# Altium schematic sheet Communication_Main.SchDoc: EMRT MAIN CONTROLLER
size B; DrawnBy: HUST; DocumentNumber: 9321-E-1101; Revision: REV.B; SheetNumber: 1; SheetTotal: 4
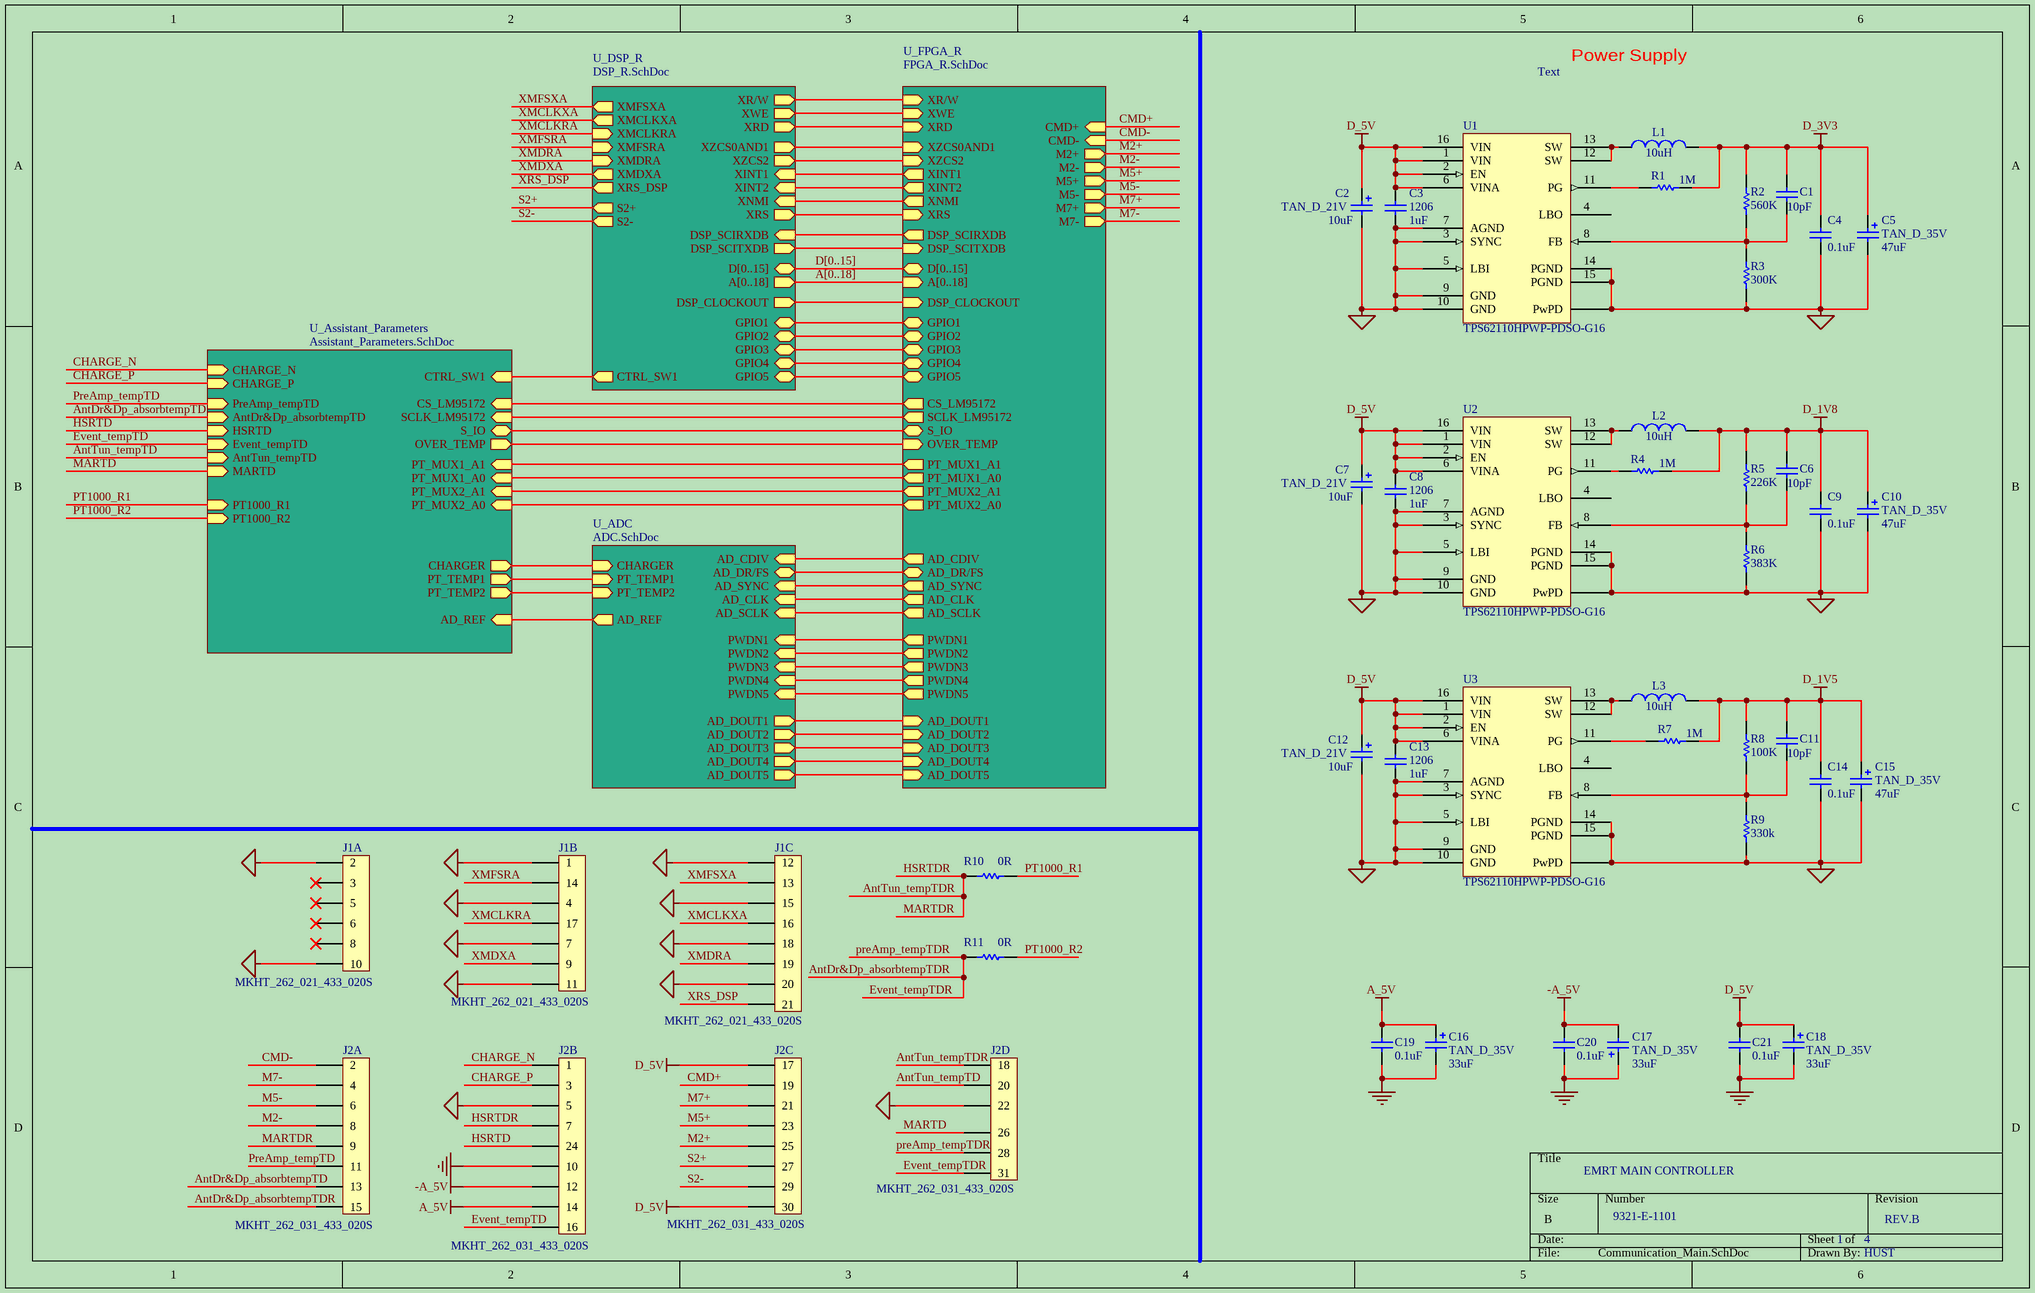
[diagram p0: Communication_Main.SchDoc]

## Parts
C1  value 10pF  [CAPS0805_57]  (hidden comment: Cap)
C2  TAN_D_21V  value 10uF  [CAPSP_2q2917]
C3  1206  value 1uF  [CAPS1206_43]
C4  value 0.1uF  [CAPS0805_57]  (hidden comment: Cap)
C5  TAN_D_35V  value 47uF  [CAPSP_2q2917]
C6  value 10pF  [CAPS0805_57]  (hidden comment: Cap)
C7  TAN_D_21V  value 10uF  [CAPSP_2q2917]
C8  1206  value 1uF  [CAPS1206_43]
C9  value 0.1uF  [CAPS0805_57]  (hidden comment: Cap)
C10  TAN_D_35V  value 47uF  [CAPSP_2q2917]
C11  value 10pF  [CAPS0805_57]  (hidden comment: Cap)
C12  TAN_D_21V  value 10uF  [CAPSP_2q2917]
C13  1206  value 1uF  [CAPS1206_43]
C14  value 0.1uF  [CAPS0805_57]  (hidden comment: Cap)
C15  TAN_D_35V  value 47uF  [CAPSP_2q2917]
C16  TAN_D_35V  value 33uF  [CAPSP_2q2917]
C17  TAN_D_35V  value 33uF  [CAPSP_2q2917]
C18  TAN_D_35V  value 33uF  [CAPSP_2q2917]
C19  value 0.1uF  [CAPS0805_57]  (hidden comment: Cap)
C20  value 0.1uF  [CAPS0805_57]  (hidden comment: Cap)
C21  value 0.1uF  [CAPS0805_57]  (hidden comment: Cap)
J1  MKHT_262_021_433_020S  [MKHT_262_021_433_020S]  (parts A,B,C of 3)
J2  MKHT_262_031_433_020S  [MKHT_262_031_433_020S]  (parts A,B,C,D of 4)
L1  value 10uH  [Inductor_HT]  (hidden comment: Inductor)
L2  value 10uH  [Inductor_HT]  (hidden comment: Inductor)
L3  value 10uH  [Inductor_HT]  (hidden comment: Inductor)
R1  value 1M  [RESS0805]  (hidden comment: Res)
R2  value 560K  [RESS0805]  (hidden comment: Res)
R3  value 300K  [RESS0805]  (hidden comment: Res)
R4  value 1M  [RESS0805]  (hidden comment: Res)
R5  value 226K  [RESS0805]  (hidden comment: Res)
R6  value 383K  [RESS0805]  (hidden comment: Res)
R7  value 1M  [RESS0805]  (hidden comment: Res)
R8  value 100K  [RESS0805]  (hidden comment: Res)
R9  value 330k  [RESS0805]  (hidden comment: Res)
R10  value 0R  [RESS0805]  (hidden comment: Res)
R11  value 0R  [RESS0805]  (hidden comment: Res)
U1  TPS62110HPWP-PDSO-G16  [PWP16]
U2  TPS62110HPWP-PDSO-G16  [PWP16]
U3  TPS62110HPWP-PDSO-G16  [PWP16]

## Sub-sheets
U_ADC = ADC.SchDoc: AD_CDIV (in), AD_DR/FS (bidir), AD_SYNC (in), PWDN1 (in), PWDN2 (in), PWDN3 (in), PWDN4 (in), AD_CLK (in), AD_SCLK (in), AD_DOUT1 (out), AD_DOUT2 (out), AD_DOUT3 (out), AD_DOUT4 (out), PT_TEMP1 (in), CHARGER (in), AD_DOUT5 (out), PWDN5 (in), AD_REF (out), PT_TEMP2 (in)
U_Assistant_Parameters = Assistant_Parameters.SchDoc: HSRTD (in), PT_TEMP1 (out), CHARGE_N (in), CHARGE_P (in), CHARGER (out), PreAmp_tempTD (in), PT1000_R1 (in), AntDr&Dp_absorbtempTD (in), CS_LM95172 (in), SCLK_LM95172 (in), S_IO (bidir), OVER_TEMP (out), Event_tempTD (in), PT_MUX2_A1 (in), PT_MUX2_A0 (in), PT_MUX1_A1 (in), PT_MUX1_A0 (in), AntTun_tempTD (in), MARTD (in), AD_REF (in), PT_TEMP2 (out), PT1000_R2 (in), CTRL_SW1 (in)
U_DSP_R = DSP_R.SchDoc: XMDXA (out), XMFSXA (out), XMCLKXA (out), XMCLKRA (in), XMFSRA (in), XMDRA (in), GPIO1 (bidir), GPIO2 (bidir), GPIO3 (bidir), GPIO4 (bidir), XRS_DSP (out), XZCS2 (out), XWE (out), XRD (out), XNMI (in), XINT1 (in), DSP_CLOCKOUT (out), GPIO5 (bidir), XINT2 (in), A[0..18] (out), D[0..15] (bidir), XZCS0AND1 (out), XRS (out), XR/W (out), DSP_SCIRXDB (in), DSP_SCITXDB (out), CTRL_SW1 (out), S2+ (out), S2- (out)
U_FPGA_R = FPGA_R.SchDoc: XINT1 (out), XNMI (out), XWE (in), XRD (in), XR/W (in), XZCS2 (in), GPIO1 (bidir), GPIO2 (bidir), GPIO3 (bidir), GPIO4 (bidir), DSP_CLOCKOUT (in), M2+ (out), M2- (out), CMD- (in), CMD+ (in), M5+ (out), M5- (out), M7+ (out), M7- (out), GPIO5 (bidir), XINT2 (out), D[0..15] (bidir), XRS (in), A[0..18] (in), XZCS0AND1 (in), AD_DOUT2 (in), AD_DOUT3 (in), AD_DOUT4 (in), AD_DOUT1 (in), AD_CDIV (out), AD_DR/FS (bidir), AD_SYNC (out), PWDN2 (out), PWDN3 (out), PWDN4 (out), PWDN1 (out), AD_CLK (out), AD_SCLK (out), CS_LM95172 (out), SCLK_LM95172 (out), S_IO (bidir), OVER_TEMP (in), AD_DOUT5 (in), PWDN5 (out), DSP_SCIRXDB (out), DSP_SCITXDB (in), PT_MUX2_A1 (out), PT_MUX2_A0 (out), PT_MUX1_A0 (out), PT_MUX1_A1 (out)

## Nets
-A_5V: C17.2 C20.1 J2.12
A_5V: C16.1 C19.2 J2.14
D_1V5: C11.2 C14.2 C15.1 L3.2 R7.2 R8.2
D_1V8: C6.2 C9.2 C10.1 L2.2 R4.2 R5.2
D_3V3: C1.2 C4.2 C5.1 L1.2 R1.2 R2.2
D_5V: C2.1 C3.2 C7.1 C8.2 C12.1 C13.2 C18.1 C21.1 J2.17 J2.30 U1.1(VIN) U1.2(EN) U1.6(VINA) U1.16(VIN) U2.1(VIN) U2.2(EN) U2.6(VINA) U2.16(VIN) U3.1(VIN) U3.2(EN) U3.6(VINA) U3.16(VIN)
DGND: C2.2 C3.1 C4.1 C5.2 C7.2 C8.1 C9.1 C10.2 C12.2 C13.1 C14.1 C15.2 J1.1 J1.2 J1.4 J1.7 J1.10 J1.11 J1.12 J1.15 J1.18 J1.20 J2.5 J2.22 R3.1 R6.1 R9.1 U1.3(SYNC) U1.5(LBI) U1.7(AGND) U1.9(GND) U1.10(GND) U1.14(PGND) U1.15(PGND) U1.PwPD U2.3(SYNC) U2.5(LBI) U2.7(AGND) U2.9(GND) U2.10(GND) U2.14(PGND) U2.15(PGND) U2.PwPD U3.3(SYNC) U3.5(LBI) U3.7(AGND) U3.9(GND) U3.10(GND) U3.14(PGND) U3.15(PGND) U3.PwPD
GND: C16.2 C17.1 C18.2 C19.1 C20.2 C21.2 J2.10
AntDr&Dp_absorbtempTD: J2.13 ; sheet U_Assistant_Parameters/AntDr&Dp_absorbtempTD
AntDr&Dp_absorbtempTDR: J2.15 J2.28 J2.31 R11.2  [also labelled Event_tempTDR, preAmp_tempTDR]
AntTun_tempTD: J2.20 ; sheet U_Assistant_Parameters/AntTun_tempTD
AntTun_tempTDR: J2.7 J2.9 J2.18 R10.2  [also labelled HSRTDR, MARTDR]
CHARGE_N: J2.1 ; sheet U_Assistant_Parameters/CHARGE_N
CHARGE_P: J2.3 ; sheet U_Assistant_Parameters/CHARGE_P
CMD+: J2.19 ; sheet U_FPGA_R/CMD+
CMD-: J2.2 ; sheet U_FPGA_R/CMD-
Event_tempTD: J2.16 ; sheet U_Assistant_Parameters/Event_tempTD
HSRTD: J2.24 ; sheet U_Assistant_Parameters/HSRTD
M2+: J2.25 ; sheet U_FPGA_R/M2+
M2-: J2.8 ; sheet U_FPGA_R/M2-
M5+: J2.23 ; sheet U_FPGA_R/M5+
M5-: J2.6 ; sheet U_FPGA_R/M5-
M7+: J2.21 ; sheet U_FPGA_R/M7+
M7-: J2.4 ; sheet U_FPGA_R/M7-
MARTD: J2.26 ; sheet U_Assistant_Parameters/MARTD
PreAmp_tempTD: J2.11 ; sheet U_Assistant_Parameters/PreAmp_tempTD
PT1000_R1: R10.1 ; sheet U_Assistant_Parameters/PT1000_R1
PT1000_R2: R11.1 ; sheet U_Assistant_Parameters/PT1000_R2
S2+: J2.27 ; sheet U_DSP_R/S2+
S2-: J2.29 ; sheet U_DSP_R/S2-
XMCLKRA: J1.17 ; sheet U_DSP_R/XMCLKRA
XMCLKXA: J1.16 ; sheet U_DSP_R/XMCLKXA
XMDRA: J1.19 ; sheet U_DSP_R/XMDRA
XMDXA: J1.9 ; sheet U_DSP_R/XMDXA
XMFSRA: J1.14 ; sheet U_DSP_R/XMFSRA
XMFSXA: J1.13 ; sheet U_DSP_R/XMFSXA
XRS_DSP: J1.21 ; sheet U_DSP_R/XRS_DSP
NetC1_1: C1.1 R2.1 R3.2 U1.8(FB)
NetC6_1: C6.1 R5.1 R6.2 U2.8(FB)
NetC11_1: C11.1 R8.1 R9.2 U3.8(FB)
NetL1_1: L1.1 U1.12(SW) U1.13(SW)
NetL2_1: L2.1 U2.12(SW) U2.13(SW)
NetL3_1: L3.1 U3.12(SW) U3.13(SW)
NetR1_1: R1.1 U1.11(PG)
NetR4_1: R4.1 U2.11(PG)
NetR7_1: R7.1 U3.11(PG)
(unnamed): sheet U_Assistant_Parameters/PT_TEMP1, sheet U_ADC/PT_TEMP1
(unnamed): sheet U_Assistant_Parameters/CHARGER, sheet U_ADC/CHARGER
(unnamed): sheet U_Assistant_Parameters/CS_LM95172, sheet U_FPGA_R/CS_LM95172
(unnamed): sheet U_Assistant_Parameters/SCLK_LM95172, sheet U_FPGA_R/SCLK_LM95172
(unnamed): sheet U_Assistant_Parameters/S_IO, sheet U_FPGA_R/S_IO
(unnamed): sheet U_Assistant_Parameters/OVER_TEMP, sheet U_FPGA_R/OVER_TEMP
(unnamed): sheet U_Assistant_Parameters/PT_MUX2_A1, sheet U_FPGA_R/PT_MUX2_A1
(unnamed): sheet U_Assistant_Parameters/PT_MUX2_A0, sheet U_FPGA_R/PT_MUX2_A0
(unnamed): sheet U_Assistant_Parameters/PT_MUX1_A1, sheet U_FPGA_R/PT_MUX1_A1
(unnamed): sheet U_Assistant_Parameters/PT_MUX1_A0, sheet U_FPGA_R/PT_MUX1_A0
(unnamed): sheet U_Assistant_Parameters/AD_REF, sheet U_ADC/AD_REF
(unnamed): sheet U_Assistant_Parameters/PT_TEMP2, sheet U_ADC/PT_TEMP2
(unnamed): sheet U_Assistant_Parameters/CTRL_SW1, sheet U_DSP_R/CTRL_SW1
(unnamed): sheet U_DSP_R/GPIO1, sheet U_FPGA_R/GPIO1
(unnamed): sheet U_DSP_R/GPIO2, sheet U_FPGA_R/GPIO2
(unnamed): sheet U_DSP_R/GPIO3, sheet U_FPGA_R/GPIO3
(unnamed): sheet U_DSP_R/GPIO4, sheet U_FPGA_R/GPIO4
(unnamed): sheet U_DSP_R/XZCS2, sheet U_FPGA_R/XZCS2
(unnamed): sheet U_DSP_R/XWE, sheet U_FPGA_R/XWE
(unnamed): sheet U_DSP_R/XRD, sheet U_FPGA_R/XRD
(unnamed): sheet U_DSP_R/XNMI, sheet U_FPGA_R/XNMI
(unnamed): sheet U_DSP_R/XINT1, sheet U_FPGA_R/XINT1
(unnamed): sheet U_DSP_R/DSP_CLOCKOUT, sheet U_FPGA_R/DSP_CLOCKOUT
(unnamed): sheet U_DSP_R/GPIO5, sheet U_FPGA_R/GPIO5
(unnamed): sheet U_DSP_R/XINT2, sheet U_FPGA_R/XINT2
(unnamed): sheet U_DSP_R/XZCS0AND1, sheet U_FPGA_R/XZCS0AND1
(unnamed): sheet U_DSP_R/XRS, sheet U_FPGA_R/XRS
(unnamed): sheet U_DSP_R/XR/W, sheet U_FPGA_R/XR/W
(unnamed): sheet U_DSP_R/DSP_SCIRXDB, sheet U_FPGA_R/DSP_SCIRXDB
(unnamed): sheet U_DSP_R/DSP_SCITXDB, sheet U_FPGA_R/DSP_SCITXDB
(unnamed): sheet U_FPGA_R/AD_DOUT2, sheet U_ADC/AD_DOUT2
(unnamed): sheet U_FPGA_R/AD_DOUT3, sheet U_ADC/AD_DOUT3
(unnamed): sheet U_FPGA_R/AD_DOUT4, sheet U_ADC/AD_DOUT4
(unnamed): sheet U_FPGA_R/AD_DOUT1, sheet U_ADC/AD_DOUT1
(unnamed): sheet U_FPGA_R/AD_CDIV, sheet U_ADC/AD_CDIV
(unnamed): sheet U_FPGA_R/AD_DR/FS, sheet U_ADC/AD_DR/FS
(unnamed): sheet U_FPGA_R/AD_SYNC, sheet U_ADC/AD_SYNC
(unnamed): sheet U_FPGA_R/PWDN2, sheet U_ADC/PWDN2
(unnamed): sheet U_FPGA_R/PWDN3, sheet U_ADC/PWDN3
(unnamed): sheet U_FPGA_R/PWDN4, sheet U_ADC/PWDN4
(unnamed): sheet U_FPGA_R/PWDN1, sheet U_ADC/PWDN1
(unnamed): sheet U_FPGA_R/AD_CLK, sheet U_ADC/AD_CLK
(unnamed): sheet U_FPGA_R/AD_SCLK, sheet U_ADC/AD_SCLK
(unnamed): sheet U_FPGA_R/AD_DOUT5, sheet U_ADC/AD_DOUT5
(unnamed): sheet U_FPGA_R/PWDN5, sheet U_ADC/PWDN5

Not connected (* = marked no-connect by the designer): J1 3* 5* 6* 8*; U1 4(LBO); U2 4(LBO); U3 4(LBO)

## Buses and harness runs
bus A[0..18] = sheet U_DSP_R/A[0..18] = sheet U_FPGA_R/A[0..18]
bus D[0..15] = sheet U_DSP_R/D[0..15] = sheet U_FPGA_R/D[0..15]

## Notes on the sheet
- Text
- Power Supply

## Library data of the parts
C1 C6 C11 = Y20025162: Capacitor; 制造商型号: 0805D100J500P; parent: 01; 精度: ±5%; 描述: NOVACAP;0805D100J500P;10pF;30±ppm/℃;±5%;50V;C0G/NP0;200℃;CAP0805; 安装形式: SMT; 湿敏等级（回流焊峰值）: 0; 产品外形尺寸<长>: 0.080±0.008 in; 产品外形尺寸<宽>: 0.050±0.008 in; 产品外形尺寸<高>: 0.054 in; id: wt.part.WTPartMaster:1047283; state: APPROVED; folder: /Default/电容/0805D100J500P; Part Number: Y20025162; HelpURL: \\10.185.226.160\altium_center_db\DATASHEET\NOVACAP High Temperature Chip.pdf; Library Path: Cap.SchLib; Library Ref: Cap; Footprint Path: NOVACAP 0805.PcbLib; Footprint Ref: CAPS0805_54; pname: 0805D100J500P; Library Path 2: 0; Library Ref 2: 0; Footprint Path 2: 0; Footprint Ref 2: 0; Footprint Path 3: 0; Footprint Ref 3: 0
C2 C7 C12 = Y20024818: Polarized Capacitor; 制造商型号: T499D106K050AT; 精度: ±10%; 描述: KEMET;T499D106K050AT;10uF;±10%;50V;175℃;CAP2917; 安装形式: SMT; 产品外形尺寸<长>: 7.3±0.30mm; 产品外形尺寸<宽>: 4.3±0.30mm; 产品外形尺寸<高>: 2.8±0.30mm; id: wt.part.WTPartMaster:1056718; state: APPROVED; folder: /Default/电容/T499D106K050AT; Part Number: Y20024818; HelpURL: \\10.185.226.160\altium_center_db\DATASHEET\KEMET T498&T499ns.pdf; pname: T499D106K050AT
C3 C8 C13 = Y20024113: Capacitor; 制造商型号: C1206C105K5RAC; parent: 01; 精度: ±10%; 描述: KEMET;C1206C105K5RAC;1uF;±10%;50V;X7R;125℃;CAP1206 MSL1; 安装形式: SMT; 湿敏等级（回流焊峰值）: MSL1; 产品外形尺寸<长>: 3.2±0.2 mm; 产品外形尺寸<宽>: 1.6±0.2 mm; 产品外形尺寸<高>: 1.0±0.1 mm; Library Path 2: 0; id: wt.part.WTPartMaster:1055130; state: APPROVED; folder: /Default/电容/C1206C105K5RAC; Part Number: Y20024113; HelpURL: \\10.185.226.160\altium_center_db\DATASHEET\KEMET X7R Dielectric(Commercial Grade).pdf; Library Path: Cap.SchLib; Library Ref: Cap; Footprint Path: KEMET C1206_43.PcbLib; Footprint Ref: CAPS1206_43; pname: C1206C105K5RAC; Library Ref 2: 0; Footprint Path 2: 0; Footprint Ref 2: 0; Footprint Path 3: 0; Footprint Ref 3: 0
C4 C9 C14 C19-C21 = Y20025084: Capacitor; 制造商型号: VJ0805H104KXA; parent: 01; 精度: ±10%; 描述: VISHAY;VJ0805H104KXA;0.1uF;±10%;50V;X8R;150℃;CAP0805; 安装形式: SMT; 湿敏等级（回流焊峰值）: 0; 产品外形尺寸<长>: 0.079±0.008 in; 产品外形尺寸<宽>: 0.049±0.008 in; 产品外形尺寸<高>: 0.057 in; id: wt.part.WTPartMaster:1053152; state: APPROVED; folder: /Default/电容/VJ0805H104KXA; Part Number: Y20025084; HelpURL: \\10.185.226.160\altium_center_db\DATASHEET\VISHAY VJ X8R.pdf; Library Path: Cap.SchLib; Library Ref: Cap; Footprint Path: VISHAY VJ0805_57.PcbLib; Footprint Ref: CAPS0805_57; pname: VJ0805H104KXA; Library Path 2: 0; Library Ref 2: 0; Footprint Path 2: 0; Footprint Ref 2: 0; Footprint Path 3: 0; Footprint Ref 3: 0
C5 C10 C15-C18 = Y20024816: Polarized Capacitor; 制造商型号: T499D476K016AT; parent: 01; 精度: ±10%; 描述: KEMET;T499D476K016AT;47uF;±10%;16V;175℃;CAP2917; 安装形式: SMT; 湿敏等级（回流焊峰值）: 0; 产品外形尺寸<长>: 7.3±0.30 mm; 产品外形尺寸<宽>: 4.3±0.30 mm; 产品外形尺寸<高>: 2.8±0.30 mm; id: wt.part.WTPartMaster:1056620; state: APPROVED; folder: /Default/电容/T499D476K016AT; Part Number: Y20024816; HelpURL: \\10.185.226.160\altium_center_db\DATASHEET\KEMET T498&T499ns.pdf; Library Path: Cap Pol.SchLib; Library Ref: Cap Pol; Footprint Path: KEMET T499-D.PcbLib; Footprint Ref: CAPSP_2q2917_122; pname: T499D476K016AT; Library Path 2: 0; Library Ref 2: 0; Footprint Path 2: 0; Footprint Ref 2: 0; Footprint Path 3: 0; Footprint Ref 3: 0
L1-L3 = Y20028214: Inductor-1; parent: 10; 描述: EPCOS;B82422H1103K000;10uH INDUCTOR SIMID 1210?H; 安装形式: SMT; 引脚数目: 2; 最低温度: 0°C; 产品外形尺寸<长>: 3.2 mm; 产品外形尺寸<宽>: 2.5 mm; 产品外形尺寸<高>: 2.2 mm; 主要参数: LR=10uH;IR=0.5A;RMAX=0.46Ω;fres,min=30MHz;Qmin=12;电感容差=±10%; pname: B82422H1103K; Library Path 2: 0; id: wt.part.WTPartMaster:1042867; state: APPROVED; folder: /lijun/Checked Out/B82422H1103K; Part Number: Y20028214; 制造商型号: B82422H1103K000; HelpURL: \\10.185.226.160\altium_center_db\DATASHEET\EPCOS B82422H.pdf; Library Path: B82422H1103K000.SchLib; Library Ref: B82422H1103K000; Footprint Path: EPCOS B82422H1103K000.PcbLib; Footprint Ref: INDS 1210-H_95; Library Ref 2: 0; Footprint Path 2: 0; Footprint Ref 2: 0; Footprint Path 3: 0; Footprint Ref 3: 0
R1-R11 = Res: Semiconductor Resistor; Manufacturer: Generic Components; Class: Passive; Published: 08/06/2000; Publisher: Altium Hobart Technology Centre; SubClass: Resistor
U1-U3 = Y20033002: 安装形式: SMT; 产品外形尺寸<高>: 1.2mm; 产品外形尺寸<长>: 6.6mm; 产品外形尺寸<宽>: 5.1mm; 引脚数目: 16; 湿敏等级（回流焊峰值）: MSL2(260C); 描述: TI;TPS62110-HPWP;175℃;HTSSOP 16PINS;MSL2(260C); id: wt.part.WTPartMaster:8901760; folder: /Default/电源及电源管理/TPS62110HPWP; 主要参数: 17-V, 1.5-A, SYNCHRONOUS STEP-DOWN CONVERTER; state: APPROVED; parent: 13; Library Path 2: 0; Part Number: Y20033002; Library Ref: TPS62110-HPWP; Footprint Path: 0; HelpURL: \\10.185.226.160\altium_center_db\DATASHEET\TI TPS62110-HT.pdf; Footprint Ref: 0; Library Path: TPS62110-HT.SchLib; 制造商型号: TPS62110-HPWP; pname: TPS62110-HPWP; Library Ref 2: 0; Footprint Path 2: 0; Footprint Ref 2: 0; Footprint Path 3: 0; Footprint Ref 3: 0